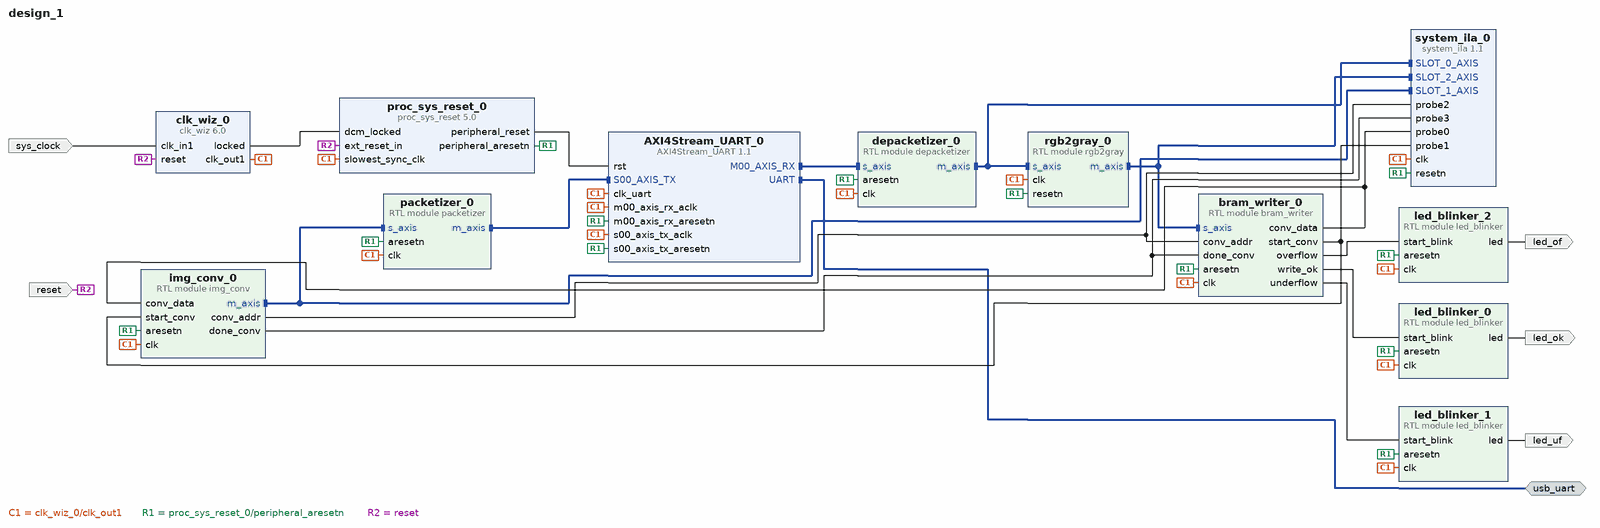
[diagram p0: block diagram of the top level]
# Vivado block design design_1, xc7a35tcpg236-1, Vivado 2020.2
create_bd_design design_1

create_bd_intf_port -mode Master -vlnv xilinx.com:interface:uart_rtl:1.0 usb_uart
create_bd_port -dir O led_ok
create_bd_port -dir O led_of
create_bd_port -dir O led_uf
create_bd_port -dir I -type rst reset
set_property -dict {CONFIG.POLARITY ACTIVE_HIGH} [get_bd_ports reset]
create_bd_port -dir I -type clk sys_clock
set_property -dict {CONFIG.FREQ_HZ 100000000 CONFIG.PHASE 0.000} [get_bd_ports sys_clock]

create_bd_cell -type ip -vlnv xilinx.com:ip:system_ila:1.1 system_ila_0
set_property -dict [list \
  CONFIG.C_MON_TYPE MIX \
  CONFIG.C_NUM_MONITOR_SLOTS 3 \
  CONFIG.C_NUM_OF_PROBES 4 \
  CONFIG.C_PROBE0_TYPE 0 \
  CONFIG.C_PROBE1_TYPE 0 \
  CONFIG.C_PROBE2_TYPE 0 \
  CONFIG.C_PROBE3_TYPE 0 \
  CONFIG.C_SLOT_0_APC_EN 0 \
  CONFIG.C_SLOT_0_AXI_DATA_SEL 1 \
  CONFIG.C_SLOT_0_AXI_TRIG_SEL 1 \
  CONFIG.C_SLOT_0_INTF_TYPE xilinx.com:interface:axis_rtl:1.0 \
  CONFIG.C_SLOT_1_APC_EN 0 \
  CONFIG.C_SLOT_1_AXI_DATA_SEL 1 \
  CONFIG.C_SLOT_1_AXI_TRIG_SEL 1 \
  CONFIG.C_SLOT_1_INTF_TYPE xilinx.com:interface:axis_rtl:1.0 \
  CONFIG.C_SLOT_2_APC_EN 0 \
  CONFIG.C_SLOT_2_AXI_DATA_SEL 1 \
  CONFIG.C_SLOT_2_AXI_TRIG_SEL 1 \
  CONFIG.C_SLOT_2_INTF_TYPE xilinx.com:interface:axis_rtl:1.0 \
] [get_bd_cells system_ila_0]
create_bd_cell -type module -reference led_blinker led_blinker_0
create_bd_cell -type module -reference packetizer packetizer_0
create_bd_cell -type module -reference depacketizer depacketizer_0
create_bd_cell -type module -reference rgb2gray rgb2gray_0
create_bd_cell -type module -reference bram_writer bram_writer_0
create_bd_cell -type module -reference led_blinker led_blinker_1
create_bd_cell -type module -reference led_blinker led_blinker_2
create_bd_cell -type ip -vlnv DigiLAB:ip:AXI4Stream_UART:1.1 AXI4Stream_UART_0
set_property -dict {CONFIG.UART_BOARD_INTERFACE usb_uart CONFIG.USE_BOARD_FLOW true} [get_bd_cells AXI4Stream_UART_0]
create_bd_cell -type ip -vlnv xilinx.com:ip:clk_wiz:6.0 clk_wiz_0
set_property -dict [list \
  CONFIG.CLK_IN1_BOARD_INTERFACE sys_clock \
  CONFIG.RESET_BOARD_INTERFACE reset \
  CONFIG.USE_BOARD_FLOW true \
] [get_bd_cells clk_wiz_0]
create_bd_cell -type ip -vlnv xilinx.com:ip:proc_sys_reset:5.0 proc_sys_reset_0
create_bd_cell -type module -reference img_conv img_conv_0

# ---- connections ----

connect_bd_intf_net -intf_net depacketizer_0_m_axis [get_bd_intf_pins depacketizer_0/m_axis] [get_bd_intf_pins rgb2gray_0/s_axis]
connect_bd_intf_net [get_bd_intf_pins depacketizer_0/m_axis] [get_bd_intf_pins system_ila_0/SLOT_0_AXIS]
connect_bd_intf_net -intf_net img_conv_0_m_axis [get_bd_intf_pins img_conv_0/m_axis] [get_bd_intf_pins packetizer_0/s_axis]
connect_bd_intf_net [get_bd_intf_pins img_conv_0/m_axis] [get_bd_intf_pins system_ila_0/SLOT_1_AXIS]
connect_bd_intf_net -intf_net rgb2gray_0_m_axis [get_bd_intf_pins rgb2gray_0/m_axis] [get_bd_intf_pins bram_writer_0/s_axis]
connect_bd_intf_net [get_bd_intf_pins rgb2gray_0/m_axis] [get_bd_intf_pins system_ila_0/SLOT_2_AXIS]
connect_bd_intf_net [get_bd_intf_pins depacketizer_0/s_axis] [get_bd_intf_pins AXI4Stream_UART_0/M00_AXIS_RX]
connect_bd_intf_net [get_bd_intf_ports usb_uart] [get_bd_intf_pins AXI4Stream_UART_0/UART]
connect_bd_intf_net [get_bd_intf_pins packetizer_0/m_axis] [get_bd_intf_pins AXI4Stream_UART_0/S00_AXIS_TX]
connect_bd_net [get_bd_pins clk_wiz_0/clk_out1] \
  [get_bd_pins system_ila_0/clk] [get_bd_pins led_blinker_0/clk] [get_bd_pins packetizer_0/clk] \
  [get_bd_pins depacketizer_0/clk] [get_bd_pins rgb2gray_0/clk] [get_bd_pins bram_writer_0/clk] \
  [get_bd_pins led_blinker_1/clk] [get_bd_pins led_blinker_2/clk] [get_bd_pins AXI4Stream_UART_0/clk_uart] \
  [get_bd_pins AXI4Stream_UART_0/m00_axis_rx_aclk] [get_bd_pins AXI4Stream_UART_0/s00_axis_tx_aclk] \
  [get_bd_pins proc_sys_reset_0/slowest_sync_clk] [get_bd_pins img_conv_0/clk]
connect_bd_net [get_bd_pins clk_wiz_0/locked] [get_bd_pins proc_sys_reset_0/dcm_locked]
connect_bd_net [get_bd_pins proc_sys_reset_0/peripheral_aresetn] \
  [get_bd_pins system_ila_0/resetn] [get_bd_pins led_blinker_0/aresetn] [get_bd_pins packetizer_0/aresetn] \
  [get_bd_pins depacketizer_0/aresetn] [get_bd_pins rgb2gray_0/resetn] [get_bd_pins bram_writer_0/aresetn] \
  [get_bd_pins led_blinker_1/aresetn] [get_bd_pins led_blinker_2/aresetn] [get_bd_pins AXI4Stream_UART_0/m00_axis_rx_aresetn] \
  [get_bd_pins AXI4Stream_UART_0/s00_axis_tx_aresetn] [get_bd_pins img_conv_0/aresetn]
connect_bd_net [get_bd_pins proc_sys_reset_0/peripheral_reset] [get_bd_pins AXI4Stream_UART_0/rst]
connect_bd_net [get_bd_pins bram_writer_0/write_ok] [get_bd_pins led_blinker_0/start_blink]
connect_bd_net [get_bd_pins bram_writer_0/overflow] [get_bd_pins led_blinker_2/start_blink]
connect_bd_net [get_bd_pins bram_writer_0/underflow] [get_bd_pins led_blinker_1/start_blink]
connect_bd_net [get_bd_pins led_blinker_0/led] [get_bd_ports led_ok]
connect_bd_net [get_bd_pins led_blinker_2/led] [get_bd_ports led_of]
connect_bd_net [get_bd_pins led_blinker_1/led] [get_bd_ports led_uf]
connect_bd_net -net bram_writer_0_conv_data [get_bd_pins bram_writer_0/conv_data] [get_bd_pins system_ila_0/probe0] [get_bd_pins img_conv_0/conv_data]
connect_bd_net -net img_conv_0_conv_addr [get_bd_pins img_conv_0/conv_addr] [get_bd_pins system_ila_0/probe2] [get_bd_pins bram_writer_0/conv_addr]
connect_bd_net -net img_conv_0_done_conv [get_bd_pins img_conv_0/done_conv] [get_bd_pins system_ila_0/probe3] [get_bd_pins bram_writer_0/done_conv]
connect_bd_net -net bram_writer_0_start_conv [get_bd_pins bram_writer_0/start_conv] \
  [get_bd_pins system_ila_0/probe1] [get_bd_pins img_conv_0/start_conv]
connect_bd_net [get_bd_ports reset] [get_bd_pins clk_wiz_0/reset] [get_bd_pins proc_sys_reset_0/ext_reset_in]
connect_bd_net [get_bd_ports sys_clock] [get_bd_pins clk_wiz_0/clk_in1]
set_property HDL_ATTRIBUTE.DEBUG true [get_bd_intf_nets depacketizer_0_m_axis]
set_property HDL_ATTRIBUTE.MARK_DEBUG true [get_bd_intf_nets depacketizer_0_m_axis]
set_property HDL_ATTRIBUTE.DEBUG true [get_bd_intf_nets img_conv_0_m_axis]
set_property HDL_ATTRIBUTE.MARK_DEBUG true [get_bd_intf_nets img_conv_0_m_axis]
set_property HDL_ATTRIBUTE.DEBUG true [get_bd_intf_nets rgb2gray_0_m_axis]
set_property HDL_ATTRIBUTE.MARK_DEBUG true [get_bd_intf_nets rgb2gray_0_m_axis]
set_property HDL_ATTRIBUTE.DEBUG true [get_bd_nets bram_writer_0_conv_data]
set_property HDL_ATTRIBUTE.MARK_DEBUG true [get_bd_nets bram_writer_0_conv_data]
set_property HDL_ATTRIBUTE.DEBUG true [get_bd_nets img_conv_0_conv_addr]
set_property HDL_ATTRIBUTE.MARK_DEBUG true [get_bd_nets img_conv_0_conv_addr]
set_property HDL_ATTRIBUTE.DEBUG true [get_bd_nets img_conv_0_done_conv]
set_property HDL_ATTRIBUTE.MARK_DEBUG true [get_bd_nets img_conv_0_done_conv]
set_property HDL_ATTRIBUTE.DEBUG true [get_bd_nets bram_writer_0_start_conv]
set_property HDL_ATTRIBUTE.MARK_DEBUG true [get_bd_nets bram_writer_0_start_conv]

validate_bd_design
save_bd_design
